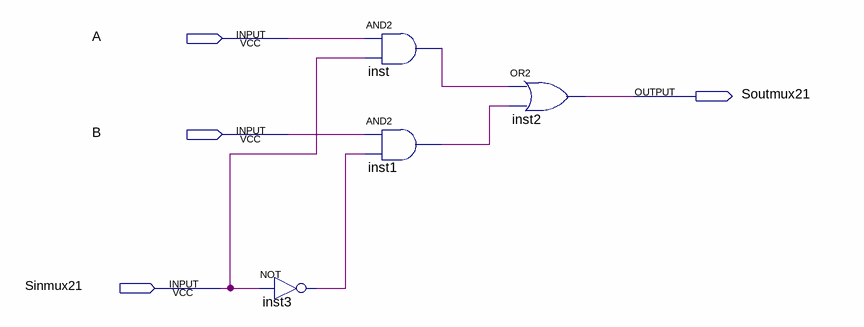
[diagram p0: schematic sheet]
// Quartus schematic mux21.bdf as structural Verilog: 4 symbols, 4 pins
module mux21 (
  input  A,
  input  B,
  input  Sinmux21,
  output Soutmux21
);

  wire inst1_out, inst3_out, inst_out;

  not inst3 (inst3_out, Sinmux21);
  and inst (inst_out, A, Sinmux21);
  and inst1 (inst1_out, B, inst3_out);
  or inst2 (Soutmux21, inst_out, inst1_out);
endmodule
